# EAGLE schematic FastDataAcqSch (EAGLE 6.5.0)

## Sheet 1 of 3: ADC to FPGA
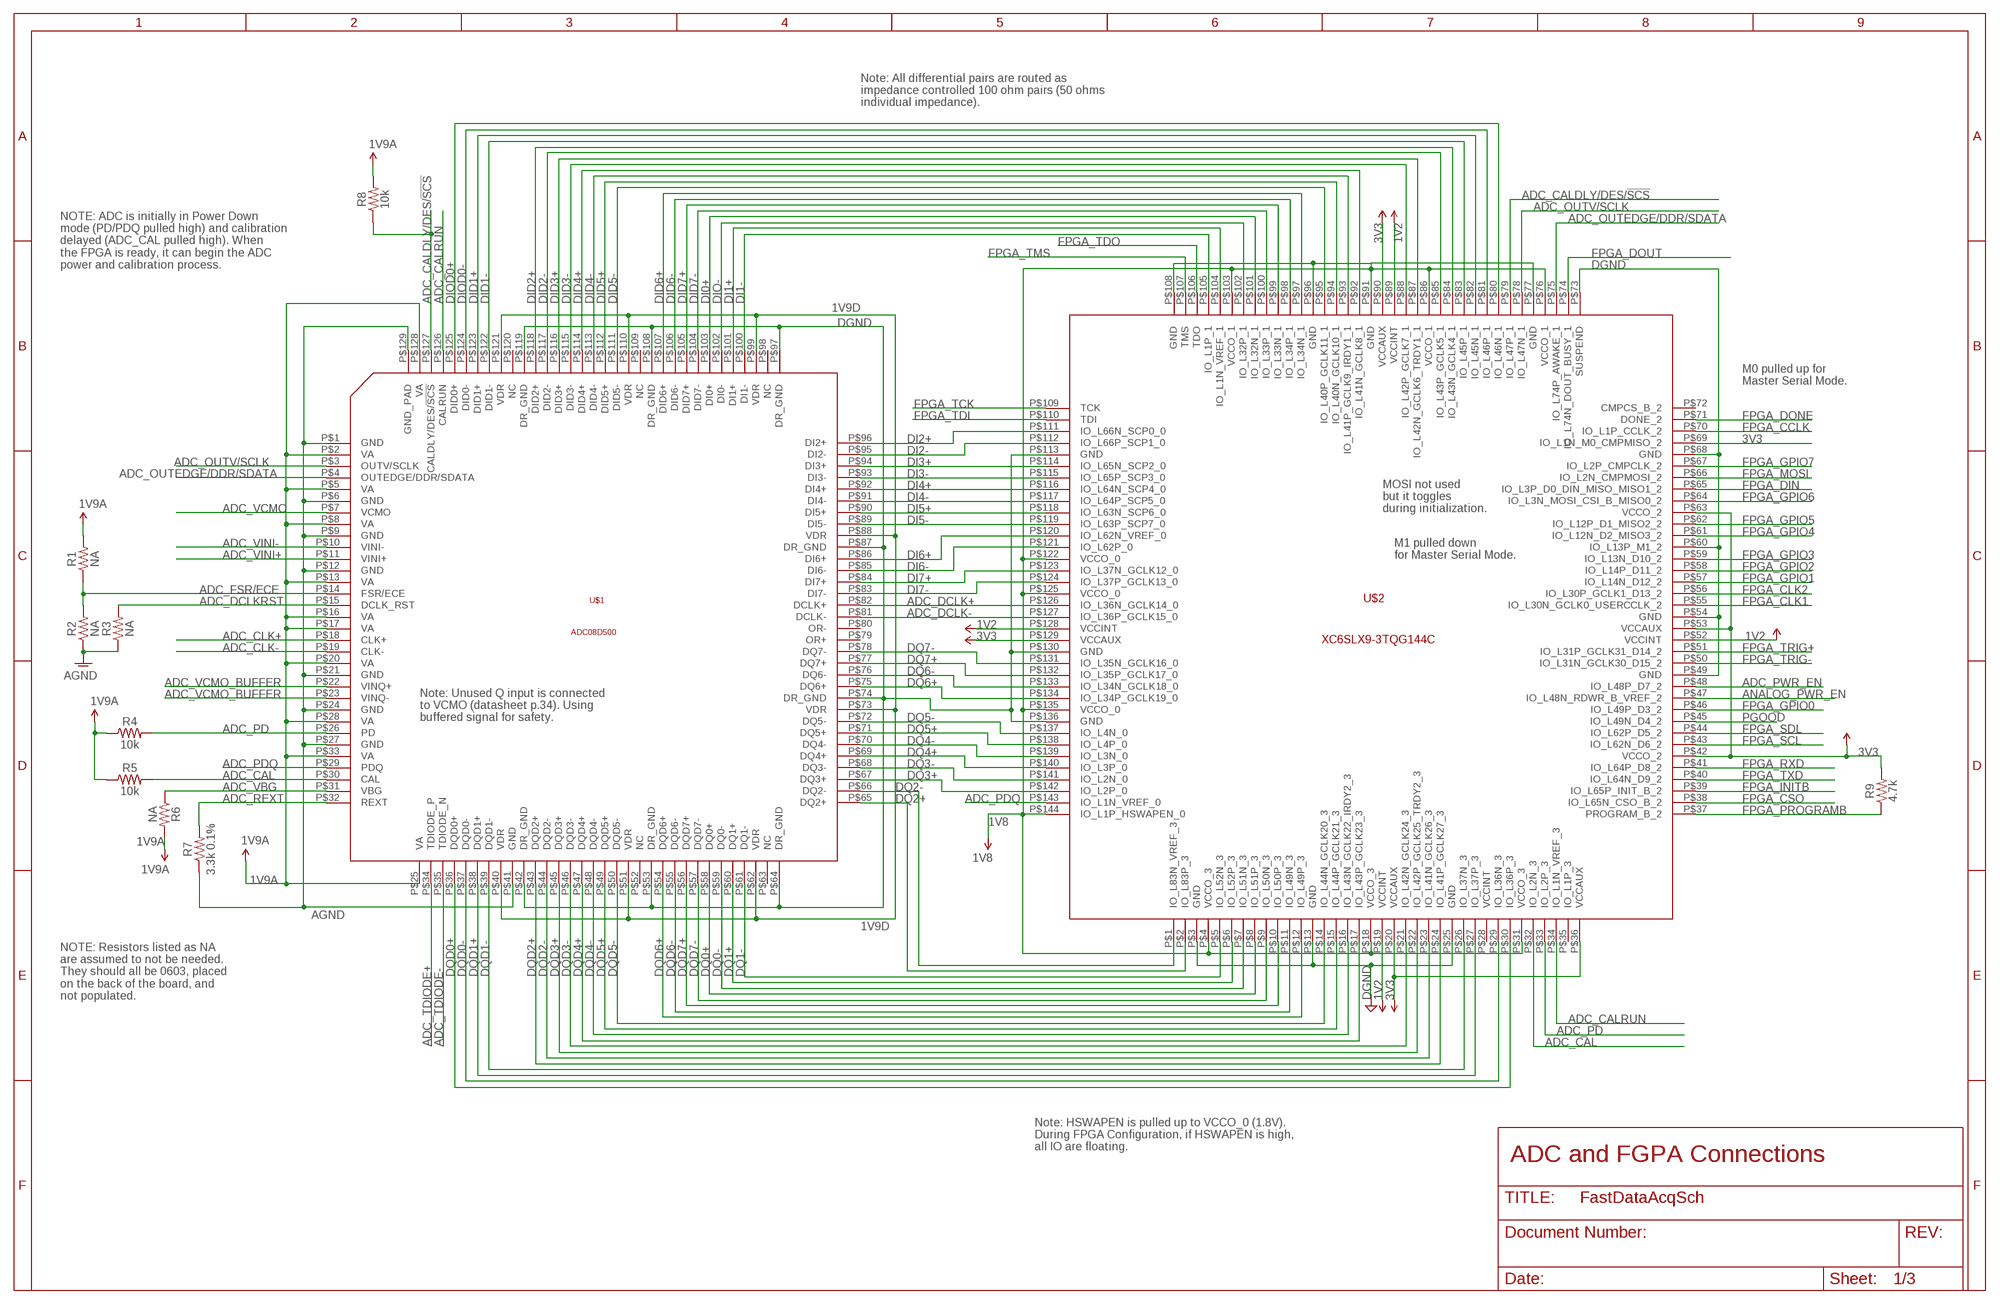
[diagram p0: schematic, sheet 1]

### Parts
R1  NA  R-US_R0603  [R0603]
R2  NA  R-US_R0603  [R0603]
R3  NA  R-US_R0603  [R0603]
R4  10k  R-US_R0201  [R0201]
R5  10k  R-US_R0201  [R0201]
R6  NA  R-US_R0603  [R0603]
R7  3.3k 0.1%  R-US_R0603  [R0603]
R8  10k  R-US_R0201  [R0201]
R9  4.7k  R-US_R0201  [R0201]
U$1  ADC08D500  [128HLQFP]
U$2  XC6SLX9-3TQG144C  [TQG144]

### Nets
1V2: U$2.P$52(VCCINT) U$2.P$89(VCCINT) U$2.P$128(VCCINT) ; also sheet 2
1V8: U$2.P$4(VCCO_3) U$2.P$18(VCCO_3) U$2.P$31(VCCO_3) U$2.P$76(VCCO_1) U$2.P$77(GND) U$2.P$86(VCCO_1) U$2.P$103(VCCO_1) U$2.P$122(VCCO_0) U$2.P$125(VCCO_0) U$2.P$135(VCCO_0) U$2.P$144(IO_L1P_HSWAPEN_0) ; also sheet 2
1V9A: R1.2 R4.1 R5.1 R6.2 R8.2 U$1.P$2(VA) U$1.P$5(VA) U$1.P$8(VA) U$1.P$13(VA) U$1.P$16(VA) U$1.P$17(VA) U$1.P$20(VA) U$1.P$25(VA) U$1.P$28(VA) U$1.P$33(VA) U$1.P$128(VA) ; also sheet 2
1V9D: U$1.P$40(VDR) U$1.P$51(VDR) U$1.P$62(VDR) U$1.P$73(VDR) U$1.P$88(VDR) U$1.P$99(VDR) U$1.P$110(VDR) U$1.P$121(VDR) ; also sheet 2
3V3: R9.2 U$2.P$36(VCCAUX) U$2.P$42(VCCO_2) U$2.P$53(VCCAUX) U$2.P$63(VCCO_2) U$2.P$69(IO_L1N_M0_CMPMISO_2) U$2.P$90(VCCAUX) U$2.P$129(VCCAUX) ; also sheet 2,3
ADC_CAL: R5.2 U$1.P$30(CAL) U$2.P$32(IO_L2N_3)
ADC_CALDLY/DES/!SCS: R8.1 U$1.P$127(CALDLY/DES/!SCS) U$2.P$79(IO_L47P_1)
ADC_CALRUN: U$1.P$126(CALRUN) U$2.P$34(IO_L1N_VREF_3)
ADC_CLK+: U$1.P$18(CLK+) ; also sheet 3
ADC_CLK-: U$1.P$19(CLK-) ; also sheet 3
ADC_DCLK+: U$1.P$82(DCLK+) U$2.P$126(IO_L36N_GCLK14_0)
ADC_DCLK-: U$1.P$81(DCLK-) U$2.P$127(IO_L36P_GCLK15_0)
ADC_DCLKRST: R3.2 U$1.P$15(DCLK_RST)
ADC_FSR/ECE: R1.1 R2.2 U$1.P$14(FSR/ECE)
ADC_OUTEDGE/DDR/SDATA: U$1.P$4(OUTEDGE/DDR/SDATA) U$2.P$75(IO_L74P_AWAKE_1)
ADC_OUTV/SCLK: U$1.P$3(OUTV/SCLK) U$2.P$78(IO_L47N_1)
ADC_PD: R4.2 U$1.P$26(PD) U$2.P$33(IO_L2P_3)
ADC_PDQ: U$1.P$29(PDQ) U$2.P$143(IO_L1N_VREF_0)
ADC_PWR_EN: U$2.P$48(IO_L48P_D7_2) ; also sheet 2
ADC_REXT: R7.2 U$1.P$32(REXT)
ADC_TDIODE+: U$1.P$34(TDIODE_P) ; also sheet 3
ADC_TDIODE-: U$1.P$35(TDIODE_N) ; also sheet 3
ADC_VBG: R6.1 U$1.P$31(VBG)
ADC_VCMO: U$1.P$7(VCMO) ; also sheet 3
ADC_VCMO_BUFFER: U$1.P$22(VINQ+) U$1.P$23(VINQ-) ; also sheet 3
ADC_VINI+: U$1.P$11(VINI+) ; also sheet 3
ADC_VINI-: U$1.P$10(VINI-) ; also sheet 3
AGND: R2.1 R3.1 R7.1 U$1.P$1(GND) U$1.P$6(GND) U$1.P$9(GND) U$1.P$12(GND) U$1.P$21(GND) U$1.P$24(GND) U$1.P$27(GND) U$1.P$41(GND) U$1.P$129(GND_PAD) ; also sheet 2,3
ANALOG_PWR_EN: U$2.P$47(IO_L48N_RDWR_B_VREF_2) ; also sheet 2
DGND: U$1.P$42(DR_GND) U$1.P$53(DR_GND) U$1.P$64(DR_GND) U$1.P$74(DR_GND) U$1.P$87(DR_GND) U$1.P$97(DR_GND) U$1.P$108(DR_GND) U$1.P$119(DR_GND) U$2.P$3(GND) U$2.P$13(GND) U$2.P$25(GND) U$2.P$49(GND) U$2.P$54(GND) U$2.P$60(IO_L13P_M1_2) U$2.P$68(GND) U$2.P$73(SUSPEND) U$2.P$113(GND) U$2.P$130(GND) U$2.P$136(GND) ; also sheet 2,3
DI0+: U$1.P$103(DI0+) U$2.P$101(IO_L32N_1)
DI1+: U$1.P$101(DI1+) U$2.P$104(IO_L1N_VREF_1)
DI1-: U$1.P$100(DI1-) U$2.P$105(IO_L1P_1)
DI2+: U$1.P$96(DI2+) U$2.P$111(IO_L66N_SCP0_0)
DI2-: U$1.P$95(DI2-) U$2.P$112(IO_L66P_SCP1_0)
DI3+: U$1.P$94(DI3+) U$2.P$114(IO_L65N_SCP2_0)
DI3-: U$1.P$93(DI3-) U$2.P$115(IO_L65P_SCP3_0)
DI4+: U$1.P$92(DI4+) U$2.P$116(IO_L64N_SCP4_0)
DI4-: U$1.P$91(DI4-) U$2.P$117(IO_L64P_SCP5_0)
DI5+: U$1.P$90(DI5+) U$2.P$118(IO_L63N_SCP6_0)
DI5-: U$1.P$89(DI5-) U$2.P$119(IO_L63P_SCP7_0)
DI6+: U$1.P$86(DI6+) U$2.P$120(IO_L62N_VREF_0)
DI6-: U$1.P$85(DI6-) U$2.P$121(IO_L62P_0)
DI7+: U$1.P$84(DI7+) U$2.P$123(IO_L37N_GCLK12_0)
DI7-: U$1.P$83(DI7-) U$2.P$124(IO_L37P_GCLK13_0)
DID1+: U$1.P$123(DID1+) U$2.P$82(IO_L45N_1)
DID1-: U$1.P$122(DID1-) U$2.P$83(IO_L45P_1)
DID2+: U$1.P$118(DID2+) U$2.P$84(IO_L43N_GCLK4_1)
DID2-: U$1.P$117(DID2-) U$2.P$85(IO_L43P_GCLK5_1)
DID3+: U$1.P$116(DID3+) U$2.P$87(IO_L42N_GCLK6_TRDY1_1)
DID3-: U$1.P$115(DID3-) U$2.P$88(IO_L42P_GCLK7_1)
DID4+: U$1.P$114(DID4+) U$2.P$92(IO_L41N_GCLK8_1)
DID4-: U$1.P$113(DID4-) U$2.P$93(IO_L41P_GCLK9_IRDY1_1)
DID5+: U$1.P$112(DID5+) U$2.P$94(IO_L40N_GCLK10_1)
DID5-: U$1.P$111(DID5-) U$2.P$95(IO_L40P_GCLK11_1)
DID6+: U$1.P$107(DID6+) U$2.P$97(IO_L34N_1)
DID6-: U$1.P$106(DID6-) U$2.P$98(IO_L34P_1)
DID7+: U$1.P$105(DID7+) U$2.P$99(IO_L33N_1)
DID7-: U$1.P$104(DID7-) U$2.P$100(IO_L33P_1)
DIO-: U$1.P$102(DI0-) U$2.P$102(IO_L32P_1)
DIOD0+: U$1.P$125(DID0+) U$2.P$80(IO_L46N_1)
DIOD0-: U$1.P$124(DID0-) U$2.P$81(IO_L46P_1)
DQ0+: U$1.P$58(DQ0+) U$2.P$8(IO_L51P_3)
DQ0-: U$1.P$59(DQ0-) U$2.P$7(IO_L51N_3)
DQ1+: U$1.P$60(DQ1+) U$2.P$6(IO_L52P_3)
DQ1-: U$1.P$61(DQ1-) U$2.P$5(IO_L52N_3)
DQ2+: U$1.P$65(DQ2+) U$2.P$2(IO_L83P_3)
DQ2-: U$1.P$66(DQ2-) U$2.P$1(IO_L83N_VREF_3)
DQ3+: U$1.P$67(DQ3+) U$2.P$142(IO_L2P_0)
DQ3-: U$1.P$68(DQ3-) U$2.P$141(IO_L2N_0)
DQ4+: U$1.P$69(DQ4+) U$2.P$140(IO_L3P_0)
DQ4-: U$1.P$70(DQ4-) U$2.P$139(IO_L3N_0)
DQ5+: U$1.P$71(DQ5+) U$2.P$138(IO_L4P_0)
DQ5-: U$1.P$72(DQ5-) U$2.P$137(IO_L4N_0)
DQ6+: U$1.P$75(DQ6+) U$2.P$134(IO_L34P_GCLK19_0)
DQ6-: U$1.P$76(DQ6-) U$2.P$133(IO_L34N_GCLK18_0)
DQ7+: U$1.P$77(DQ7+) U$2.P$132(IO_L35P_GCLK17_0)
DQ7-: U$1.P$78(DQ7-) U$2.P$131(IO_L35N_GCLK16_0)
DQD0+: U$1.P$36(DQD0+) U$2.P$30(IO_L36P_3)
DQD0-: U$1.P$37(DQD0-) U$2.P$29(IO_L36N_3)
DQD1+: U$1.P$38(DQD1+) U$2.P$27(IO_L37P_3)
DQD1-: U$1.P$39(DQD1-) U$2.P$26(IO_L37N_3)
DQD2+: U$1.P$43(DQD2+) U$2.P$24(IO_L41P_GCLK27_3)
DQD2-: U$1.P$44(DQD2-) U$2.P$23(IO_L41N_GCLK26_3)
DQD3+: U$1.P$45(DQD3+) U$2.P$22(IO_L42P_GCLK25_TRDY2_3)
DQD3-: U$1.P$46(DQD3-) U$2.P$21(IO_L42N_GCLK24_3)
DQD4+: U$1.P$47(DQD4+) U$2.P$17(IO_L43P_GCLK23_3)
DQD4-: U$1.P$48(DQD4-) U$2.P$16(IO_L43N_GCLK22_IRDY2_3)
DQD5+: U$1.P$49(DQD5+) U$2.P$15(IO_L44P_GCLK21_3)
DQD5-: U$1.P$50(DQD5-) U$2.P$14(IO_L44N_GCLK20_3)
DQD6+: U$1.P$54(DQD6+) U$2.P$12(IO_L49P_3)
DQD6-: U$1.P$55(DQD6-) U$2.P$11(IO_L49N_3)
DQD7+: U$1.P$56(DQD7+) U$2.P$10(IO_L50P_3)
DQD7-: U$1.P$57(DQD7-) U$2.P$9(IO_L50N_3)
FPGA_CCLK: U$2.P$70(IO_L1P_CCLK_2) ; also sheet 3
FPGA_CLK1: U$2.P$55(IO_L30N_GCLK0_USERCCLK_2) ; also sheet 3
FPGA_CLK2: U$2.P$56(IO_L30P_GCLK1_D13_2) ; also sheet 3
FPGA_CSO: U$2.P$38(IO_L65N_CSO_B_2)
FPGA_DIN: U$2.P$65(IO_L3P_D0_DIN_MISO_MISO1_2) ; also sheet 3
FPGA_DONE: U$2.P$71(DONE_2) ; also sheet 3
FPGA_DOUT: U$2.P$74(IO_L74N_DOUT_BUSY_1)
FPGA_GPIO0: U$2.P$46(IO_L49P_D3_2) ; also sheet 3
FPGA_GPIO1: U$2.P$57(IO_L14N_D12_2) ; also sheet 3
FPGA_GPIO2: U$2.P$58(IO_L14P_D11_2) ; also sheet 3
FPGA_GPIO3: U$2.P$59(IO_L13N_D10_2) ; also sheet 3
FPGA_GPIO4: U$2.P$61(IO_L12N_D2_MISO3_2) ; also sheet 3
FPGA_GPIO5: U$2.P$62(IO_L12P_D1_MISO2_2) ; also sheet 3
FPGA_GPIO6: U$2.P$64(IO_L3N_MOSI_CSI_B_MISO0_2) ; also sheet 3
FPGA_GPIO7: U$2.P$67(IO_L2P_CMPCLK_2) ; also sheet 3
FPGA_INITB: U$2.P$39(IO_L65P_INIT_B_2) ; also sheet 3
FPGA_MOSI: U$2.P$66(IO_L2N_CMPMOSI_2)
FPGA_PROGRAMB: R9.1 U$2.P$37(PROGRAM_B_2) ; also sheet 3
FPGA_RXD: U$2.P$41(IO_L64P_D8_2) ; also sheet 3
FPGA_SCL: U$2.P$43(IO_L62N_D6_2) ; also sheet 3
FPGA_SDL: U$2.P$44(IO_L62P_D5_2)
FPGA_TCK: U$2.P$109(TCK) ; also sheet 3
FPGA_TDI: U$2.P$110(TDI) ; also sheet 3
FPGA_TDO: U$2.P$106(TDO) ; also sheet 3
FPGA_TMS: U$2.P$107(TMS) ; also sheet 3
FPGA_TRIG+: U$2.P$51(IO_L31P_GCLK31_D14_2) ; also sheet 3
FPGA_TRIG-: U$2.P$50(IO_L31N_GCLK30_D15_2) ; also sheet 3
FPGA_TXD: U$2.P$40(IO_L64N_D9_2) ; also sheet 3
N$26: U$2.P$91(GND) U$2.P$96(GND) U$2.P$108(GND)
PGOOD: U$2.P$45(IO_L49N_D4_2) ; also sheet 2
Unconnected: U$1.P$52(NC) U$1.P$63(NC) U$1.P$79(OR+) U$1.P$80(OR-) U$1.P$98(NC) U$1.P$109(NC) U$1.P$120(NC) U$2.P$35(IO_L1P_3) U$2.P$72(CMPCS_B_2)

### Notes on the sheet
- Note: All differential pairs are routed as 
  impedance controlled 100 ohm pairs (50 ohms
  individual impedance).
- NOTE: ADC is initially in Power Down
  mode (PD/PDQ pulled high) and calibration
  delayed (ADC_CAL pulled high). When
  the FPGA is ready, it can begin the ADC
  power and calibration process.
- M0 pulled up for 
  Master Serial Mode.
- MOSI not used 
  but it toggles 
  during initialization.
- M1 pulled down 
  for Master Serial Mode.
- Note: Unused Q input is connected
  to VCMO (datasheet p.34). Using
  buffered signal for safety.
- NOTE: Resistors listed as NA 
  are assumed to not be needed. 
  They should all be 0603, placed 
  on the back of the board, and 
  not populated.
- Note: HSWAPEN is pulled up to VCCO_0 (1.8V).
  During FPGA Configuration, if HSWAPEN is high,
  all IO are floating.
- ADC and FGPA Connections

## Sheet 2 of 3: Power and Bypassing
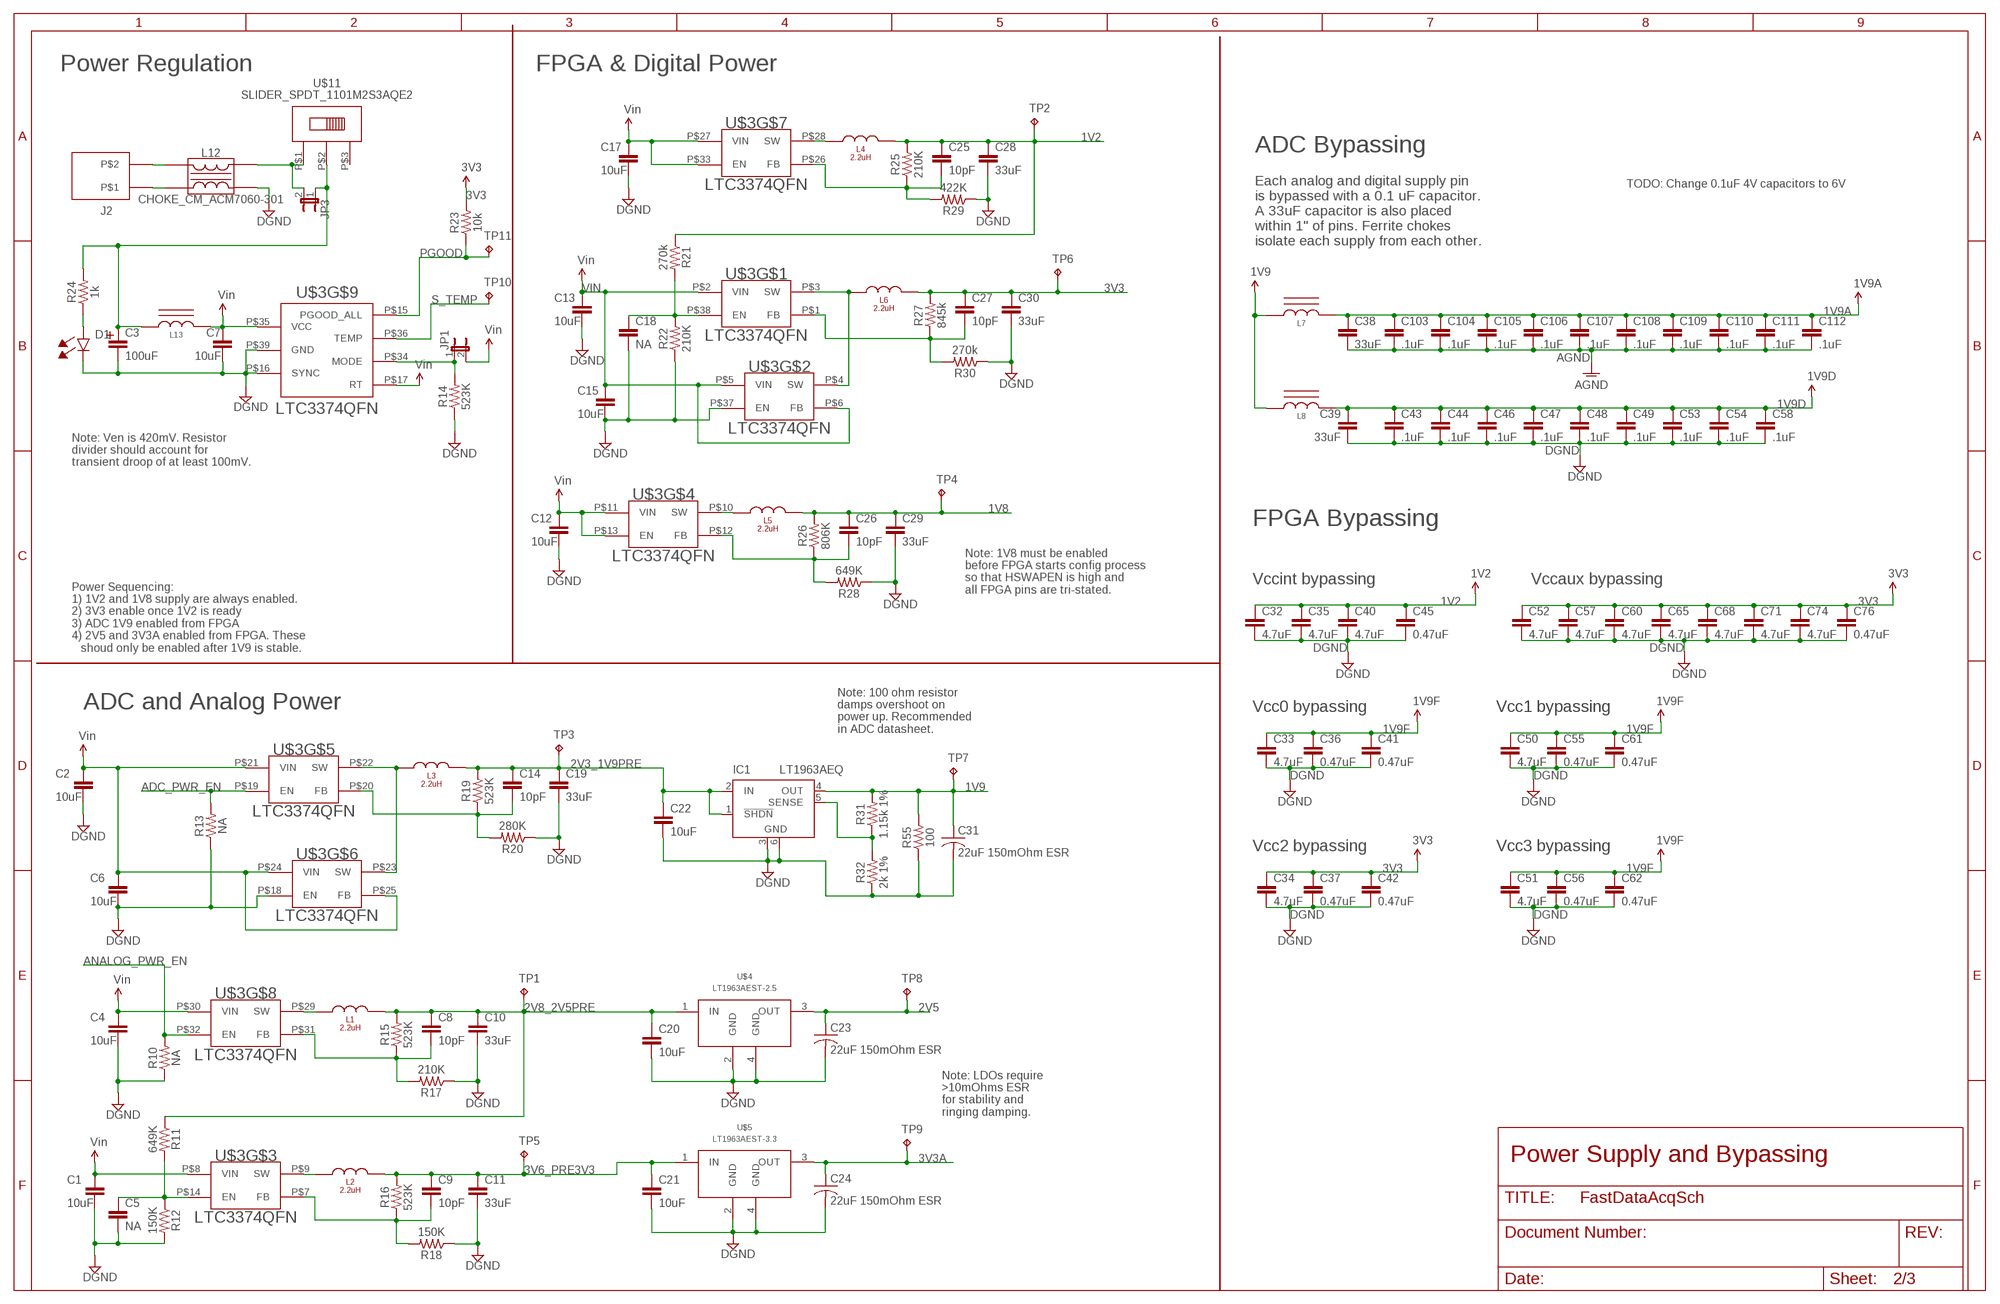
[diagram p1: schematic, sheet 2]

### Parts
C1  10uF  C-EUC0603  [C0603]
C2  10uF  C-EUC0603  [C0603]
C3  100uF  CAP_POL_D9_SERIES  [2917_MURATA_CAP]
C4  10uF  C-EUC0603  [C0603]
C5  NA  C-EUC0603  [C0603]
C6  10uF  C-EUC0603  [C0603]
C7  10uF  C-EUC0603  [C0603]
C8  10pF  C-EUC0201  [C0201]
C9  10pF  C-EUC0201  [C0201]
C10  33uF  CAP0805  [0805]
C11  33uF  CAP0805  [0805]
C12  10uF  C-EUC0603  [C0603]
C13  10uF  C-EUC0603  [C0603]
C14  10pF  C-EUC0201  [C0201]
C15  10uF  C-EUC0603  [C0603]
C17  10uF  C-EUC0603  [C0603]
C18  NA  C-EUC0603  [C0603]
C19  33uF  CAP0805  [0805]
C20  10uF  C-EUC0603  [C0603]
C21  10uF  C-EUC0603  [C0603]
C22  10uF  C-EUC0603  [C0603]
C23  22uF 150mOhm ESR  C-USC0805  [C0805]
C24  22uF 150mOhm ESR  C-USC0805  [C0805]
C25  10pF  C-EUC0201  [C0201]
C26  10pF  C-EUC0201  [C0201]
C27  10pF  C-EUC0201  [C0201]
C28  33uF  CAP0805  [0805]
C29  33uF  CAP0805  [0805]
C30  33uF  CAP0805  [0805]
C31  22uF 150mOhm ESR  C-USC0805  [C0805]
C32  4.7uF  CAPACITOR0304_REVERSE  [0306REVERSE]
C33  4.7uF  CAPACITOR0304_REVERSE  [0306REVERSE]
C34  4.7uF  CAPACITOR0304_REVERSE  [0306REVERSE]
C35  4.7uF  CAPACITOR0304_REVERSE  [0306REVERSE]
C36  0.47uF  CAPACITOR0304_REVERSE  [0306REVERSE]
C37  0.47uF  CAPACITOR0304_REVERSE  [0306REVERSE]
C38  33uF  CAP0805  [0805]
C39  33uF  CAP0805  [0805]
C40  4.7uF  CAPACITOR0304_REVERSE  [0306REVERSE]
C41  0.47uF  CAPACITOR0304_REVERSE  [0306REVERSE]
C42  0.47uF  CAPACITOR0304_REVERSE  [0306REVERSE]
C43  .1uF  CAPACITOR0204_REVERSE  [0204REVERSE]
C44  .1uF  CAPACITOR0204_REVERSE  [0204REVERSE]
C45  0.47uF  CAPACITOR0304_REVERSE  [0306REVERSE]
C46  .1uF  CAPACITOR0204_REVERSE  [0204REVERSE]
C47  .1uF  CAPACITOR0204_REVERSE  [0204REVERSE]
C48  .1uF  CAPACITOR0204_REVERSE  [0204REVERSE]
C49  .1uF  CAPACITOR0204_REVERSE  [0204REVERSE]
C50  4.7uF  CAPACITOR0304_REVERSE  [0306REVERSE]
C51  4.7uF  CAPACITOR0304_REVERSE  [0306REVERSE]
C52  4.7uF  CAPACITOR0304_REVERSE  [0306REVERSE]
C53  .1uF  CAPACITOR0204_REVERSE  [0204REVERSE]
C54  .1uF  CAPACITOR0204_REVERSE  [0204REVERSE]
C55  0.47uF  CAPACITOR0304_REVERSE  [0306REVERSE]
C56  0.47uF  CAPACITOR0304_REVERSE  [0306REVERSE]
C57  4.7uF  CAPACITOR0304_REVERSE  [0306REVERSE]
C58  .1uF  CAPACITOR0204_REVERSE  [0204REVERSE]
C60  4.7uF  CAPACITOR0304_REVERSE  [0306REVERSE]
C61  0.47uF  CAPACITOR0304_REVERSE  [0306REVERSE]
C62  0.47uF  CAPACITOR0304_REVERSE  [0306REVERSE]
C65  4.7uF  CAPACITOR0304_REVERSE  [0306REVERSE]
C68  4.7uF  CAPACITOR0304_REVERSE  [0306REVERSE]
C71  4.7uF  CAPACITOR0304_REVERSE  [0306REVERSE]
C74  4.7uF  CAPACITOR0304_REVERSE  [0306REVERSE]
C76  0.47uF  CAPACITOR0304_REVERSE  [0306REVERSE]
C103  .1uF  CAPACITOR0204_REVERSE  [0204REVERSE]
C104  .1uF  CAPACITOR0204_REVERSE  [0204REVERSE]
C105  .1uF  CAPACITOR0204_REVERSE  [0204REVERSE]
C106  .1uF  CAPACITOR0204_REVERSE  [0204REVERSE]
C107  .1uF  CAPACITOR0204_REVERSE  [0204REVERSE]
C108  .1uF  CAPACITOR0204_REVERSE  [0204REVERSE]
C109  .1uF  CAPACITOR0204_REVERSE  [0204REVERSE]
C110  .1uF  CAPACITOR0204_REVERSE  [0204REVERSE]
C111  .1uF  CAPACITOR0204_REVERSE  [0204REVERSE]
C112  .1uF  CAPACITOR0204_REVERSE  [0204REVERSE]
D1  LED_0603_RED  [0603_LED]
IC1  LT1963AEQ  [Q5-DD]
J2  MICRO-FIT_3.0_2POS_RA_SMD  [MICRO-FIT_3.02POS_RA_SMD]
JP1  JUMPER-2PTH  [1X02]
JP3  JUMPER-2PTH  [1X02]
L1  2.2uH  INDUCTOR_3X3.6  [3.0X3.6_VISHAY]
L2  2.2uH  INDUCTOR_3X3.6  [3.0X3.6_VISHAY]
L3  2.2uH  INDUCTOR_5.18X5.49  [5.18X5.49_VISHAY]
L4  2.2uH  INDUCTOR_3X3.6  [3.0X3.6_VISHAY]
L5  2.2uH  INDUCTOR_3X3.6  [3.0X3.6_VISHAY]
L6  2.2uH  INDUCTOR_5.18X5.49  [5.18X5.49_VISHAY]
L7  FERRITE_BEADS_BLM18SG260  [MURATA_BLM18]
L8  FERRITE_BEADS_BLM18SG260  [MURATA_BLM18]
L12  CHOKE_CM_ACM7060-301  [ACM7060_CHOKE]
L13  FERRITE_BEADS_BLM18SG260  [MURATA_BLM18]
R10  NA  R-US_R0603  [R0603]
R11  649K  R-US_R0201  [R0201]
R12  150K  R-US_R0201  [R0201]
R13  NA  R-US_R0603  [R0603]
R14  523K  R-US_R0201  [R0201]
R15  523K  R-US_R0201  [R0201]
R16  523K  R-US_R0201  [R0201]
R17  210K  R-US_R0201  [R0201]
R18  150K  R-US_R0201  [R0201]
R19  523K  R-US_R0201  [R0201]
R20  280K  R-US_R0201  [R0201]
R21  270k  R-US_R0201  [R0201]
R22  210K  R-US_R0201  [R0201]
R23  10k  R-US_R0201  [R0201]
R24  1k  R-US_R0201  [R0201]
R25  210K  R-US_R0201  [R0201]
R26  806K  R-US_R0201  [R0201]
R27  845k  R-US_R0201  [R0201]
R28  649K  R-US_R0201  [R0201]
R29  422K  R-US_R0201  [R0201]
R30  270k  R-US_R0201  [R0201]
R31  1.15k 1%  R-US_R0603  [R0603]
R32  2k 1%  R-US_R0603  [R0603]
R55  100  R-US_R0603  [R0603]
TP1  TPPAD1-13  [P1-13]
TP2  TPPAD1-13  [P1-13]
TP3  TPPAD1-13  [P1-13]
TP4  TPPAD1-13  [P1-13]
TP5  TPPAD1-13  [P1-13]
TP6  TPPAD1-13  [P1-13]
TP7  TPPAD1-13  [P1-13]
TP8  TPPAD1-13  [P1-13]
TP9  TPPAD1-13  [P1-13]
TP10  TPPAD1-13  [P1-13]
TP11  TPPAD1-13  [P1-13]
U$3  LTC3374QFN  [38-QFN_(5X7)]
U$4  LT1963AEST-2.5  [SOT223]
U$5  LT1963AEST-3.3  [SOT223]
U$11  SLIDER_SPDT_1101M2S3AQE2  [C_AND_K_1101M2S3AQE2]

### Nets
1V2: C25.1 C28.1 C32.P$1 C35.P$1 C40.P$1 C45.P$1 L4.P$2 R21.1 R25.2 TP2.TP ; also sheet 1
1V8: C26.1 C29.1 L5.P$2 R26.2 TP4.TP ; also sheet 1
1V9: C31.1 IC1.4(OUT) L7.P$1 L8.P$1 R31.2 R55.2 TP7.TP
1V9A: C38.1 C103.P$1 C104.P$1 C105.P$1 C106.P$1 C107.P$1 C108.P$1 C109.P$1 C110.P$1 C111.P$1 C112.P$1 L7.P$2 ; also sheet 1
1V9D: C39.1 C43.P$1 C44.P$1 C46.P$1 C47.P$1 C48.P$1 C49.P$1 C53.P$1 C54.P$1 C58.P$1 L8.P$2 ; also sheet 1
1V9F: C33.P$1 C36.P$1 C41.P$1 C50.P$1 C51.P$1 C55.P$1 C56.P$1 C61.P$1 C62.P$1
2V3_1V9PRE: C14.1 C19.1 C22.1 IC1.1(!SHDN) IC1.2(IN) L3.P$2 R19.2 TP3.TP
2V5: C23.1 TP8.TP U$4.3(OUT) ; also sheet 3
2V8_2V5PRE: C8.1 C10.1 C20.1 L1.P$2 R11.1 R15.2 TP1.TP U$4.1(IN)
3V3: C27.1 C30.1 C34.P$1 C37.P$1 C42.P$1 C52.P$1 C57.P$1 C60.P$1 C65.P$1 C68.P$1 C71.P$1 C74.P$1 C76.P$1 L6.P$2 R27.2 TP6.TP ; also sheet 1,3
3V3A: C24.1 TP9.TP U$5.3(OUT) ; also sheet 3
3V6_PRE3V3: C9.1 C11.1 C21.1 L2.P$2 R16.2 TP5.TP U$5.1(IN)
ADC_PWR_EN: R13.2 U$3.P$19(EN) ; also sheet 1
AGND: C38.2 C103.P$2 C104.P$2 C105.P$2 C106.P$2 C107.P$2 C108.P$2 C109.P$2 C110.P$2 C111.P$2 C112.P$2 ; also sheet 1,3
ANALOG_PWR_EN: R10.2 U$3.P$32(EN) ; also sheet 1
DGND: C1.2 C2.2 C3.P$1(NEG) C4.2 C5.2 C6.2 C7.2 C10.2 C11.2 C12.2 C13.2 C15.2 C17.2 C18.2 C19.2 C20.2 C21.2 C22.2 C23.2 C24.2 C28.2 C29.2 C30.2 C31.2 C32.P$2 C33.P$2 C34.P$2 C35.P$2 C36.P$2 C37.P$2 C39.2 C40.P$2 C41.P$2 C42.P$2 C43.P$2 C44.P$2 C45.P$2 C46.P$2 C47.P$2 C48.P$2 C49.P$2 C50.P$2 C51.P$2 C52.P$2 C53.P$2 C54.P$2 C55.P$2 C56.P$2 C57.P$2 C58.P$2 C60.P$2 C61.P$2 C62.P$2 C65.P$2 C68.P$2 C71.P$2 C74.P$2 C76.P$2 D1.CATHODE IC1.3(GND) IC1.6(GND) L12.P$3 R10.1 R12.2 R13.1 R14.1 R17.1 R18.1 R20.1 R22.1 R28.1 R29.1 R30.1 R32.1 R55.1 U$3.P$16(SYNC) U$3.P$18(EN) U$3.P$37(EN) U$3.P$39(GND) U$4.2(GND) U$4.4(GND) U$5.2(GND) U$5.4(GND) ; also sheet 1,3
N$1: JP3.2 L12.P$4 U$11.P$1
N$6: JP1.1 R14.2 U$3.P$34(MODE)
N$9: D1.ANODE R24.1
N$12: C18.1 R21.2 R22.2 U$3.P$38(EN)
N$14: IC1.5(SENSE) R31.1 R32.2
N$16: C5.1 R11.2 R12.1 U$3.P$14(EN)
N$17: C3.P$2(POS) JP3.1 L13.P$1 R24.2 U$11.P$2
PGOOD: R23.1 TP11.TP U$3.P$15(PGOOD_ALL) ; also sheet 1
POWER_IN+: J2.P$2 L12.P$1
POWER_IN-: J2.P$1 L12.P$2
S1FB: C27.2 R27.1 R30.2 U$3.P$1(FB)
S1SW: L6.P$1 U$3.P$3(SW) U$3.P$4(SW)
S3FB: C9.2 R16.1 R18.2 U$3.P$7(FB)
S3SW: L2.P$1 U$3.P$9(SW)
S4FB: C26.2 R26.1 R28.2 U$3.P$12(FB)
S4SW: L5.P$1 U$3.P$10(SW)
S5FB: C14.2 R19.1 R20.2 U$3.P$20(FB)
S5SW: L3.P$1 U$3.P$22(SW) U$3.P$23(SW)
S7FB: C25.2 R25.1 R29.2 U$3.P$26(FB)
S7SW: L4.P$1 U$3.P$28(SW)
S8FB: C8.2 R15.1 R17.2 U$3.P$31(FB)
S8SW: L1.P$1 U$3.P$29(SW)
S_TEMP: TP10.TP U$3.P$36(TEMP)
VCC: JP1.2 ; supply symbol labelled Vin
VIN: C1.1 C2.1 C4.1 C6.1 C7.1 C12.1 C13.1 C15.1 C17.1 L13.P$2 U$3.P$2(VIN) U$3.P$5(VIN) U$3.P$6(FB) U$3.P$8(VIN) U$3.P$11(VIN) U$3.P$13(EN) U$3.P$17(RT) U$3.P$21(VIN) U$3.P$24(VIN) U$3.P$25(FB) U$3.P$27(VIN) U$3.P$30(VIN) U$3.P$33(EN) U$3.P$35(VCC) ; supply symbol labelled Vin
Unconnected: R23.2 U$11.P$3

### Notes on the sheet
- Power Regulation | FPGA & Digital Power
- ADC Bypassing
- TODO: Change 0.1uF 4V capacitors to 6V
- Each analog and digital supply pin
  is bypassed with a 0.1 uF capacitor.
  A 33uF capacitor is also placed 
  within 1" of pins. Ferrite chokes 
  isolate each supply from each other.
- Note: Ven is 420mV. Resistor
  divider should account for 
  transient droop of at least 100mV.
- FPGA Bypassing
- Vccint bypassing | Vccaux bypassing
- Note: 1V8 must be enabled
  before FPGA starts config process
  so that HSWAPEN is high and
  all FPGA pins are tri-stated.
- Power Sequencing: 
  1) 1V2 and 1V8 supply are always enabled.
  2) 3V3 enable once 1V2 is ready
  3) ADC 1V9 enabled from FPGA
  4) 2V5 and 3V3A enabled from FPGA. These
     shoud only be enabled after 1V9 is stable.
- ADC and Analog Power | Vcc0 bypassing | Vcc1 bypassing
- Note: 100 ohm resistor
  damps overshoot on
  power up. Recommended
  in ADC datasheet.
- Vcc2 bypassing | Vcc3 bypassing
- Note: LDOs require
  >10mOhms ESR
  for stability and
  ringing damping.
- Power Supply and Bypassing

## Sheet 3 of 3: Ancillary Circuits (clocks, ADC front end, PROM, USB, etc.)
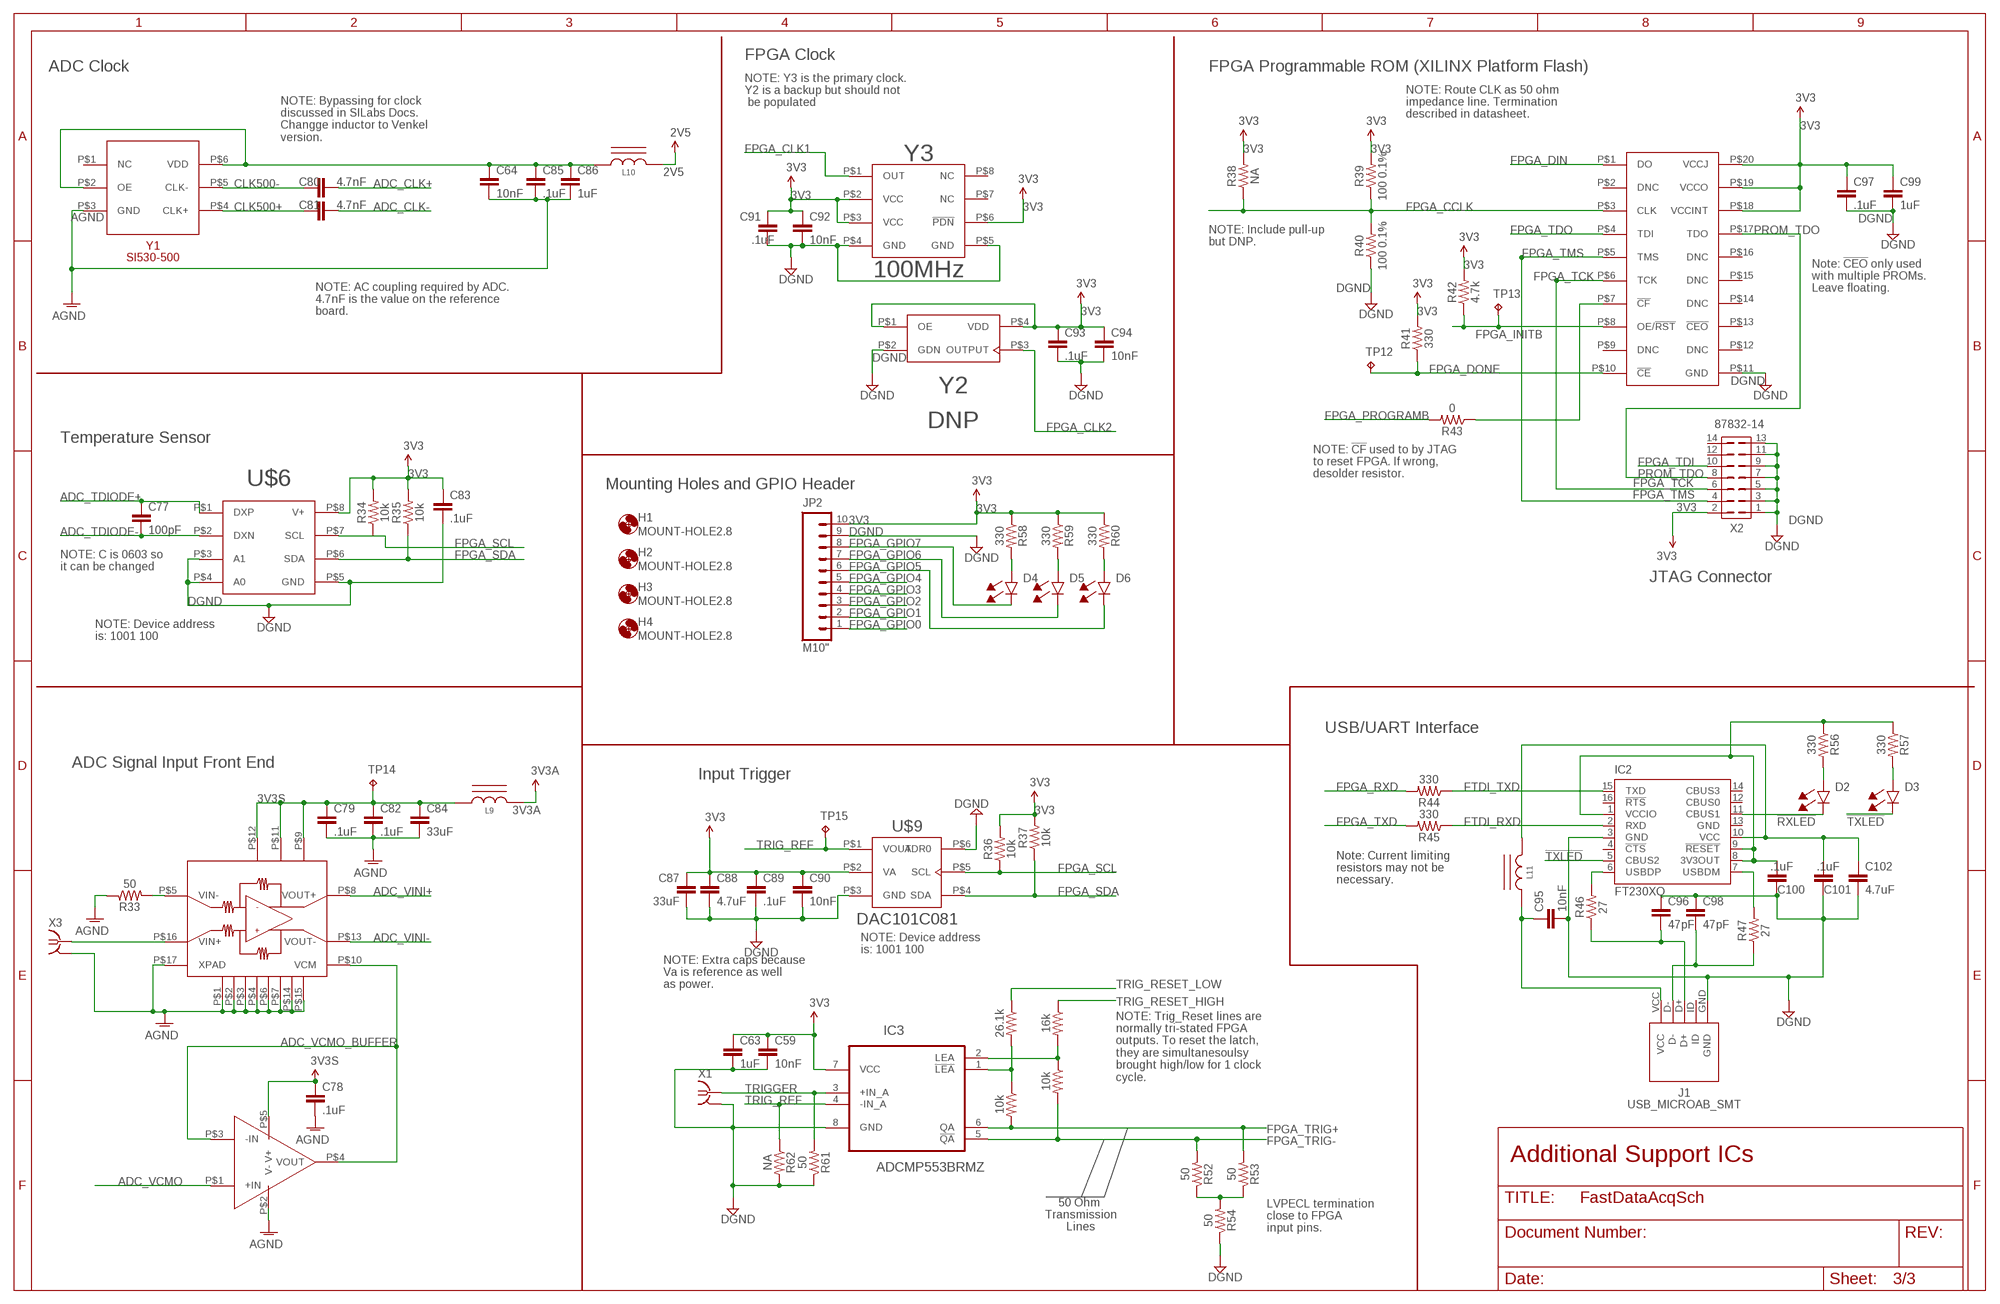
[diagram p2: schematic, sheet 3]

### Parts
C59  10nF  C-EUC0201  [C0201]
C63  1uF  CAPACITOR0204_REVERSE  [0204REVERSE]
C64  10nF  C-EUC0201  [C0201]
C77  100pF  C-EUC0603  [C0603]
C78  .1uF  CAPACITOR0204_REVERSE  [0204REVERSE]
C79  .1uF  CAPACITOR0204_REVERSE  [0204REVERSE]
C80  4.7nF  C-EUC0201  [C0201]
C81  4.7nF  C-EUC0201  [C0201]
C82  .1uF  CAPACITOR0204_REVERSE  [0204REVERSE]
C83  .1uF  CAPACITOR0204_REVERSE  [0204REVERSE]
C84  33uF  CAP0805  [0805]
C85  .1uF  CAPACITOR0204_REVERSE  [0204REVERSE]
C86  1uF  CAPACITOR0204_REVERSE  [0204REVERSE]
C87  33uF  CAP0805  [0805]
C88  4.7uF  CAPACITOR0304_REVERSE  [0306REVERSE]
C89  .1uF  CAPACITOR0204_REVERSE  [0204REVERSE]
C90  10nF  C-EUC0201  [C0201]
C91  .1uF  CAPACITOR0204_REVERSE  [0204REVERSE]
C92  10nF  C-EUC0201  [C0201]
C93  .1uF  CAPACITOR0204_REVERSE  [0204REVERSE]
C94  10nF  C-EUC0201  [C0201]
C95  10nF  C-EUC0201  [C0201]
C96  47pF  C-EUC0201  [C0201]
C97  .1uF  CAPACITOR0204_REVERSE  [0204REVERSE]
C98  47pF  C-EUC0201  [C0201]
C99  1uF  CAPACITOR0204_REVERSE  [0204REVERSE]
C100  .1uF  CAPACITOR0204_REVERSE  [0204REVERSE]
C101  .1uF  CAPACITOR0204_REVERSE  [0204REVERSE]
C102  4.7uF  CAPACITOR0304_REVERSE  [0306REVERSE]
D2  LED_0603_GREEN  [0603_LED]
D3  LED_0603_BLUE  [0603_LED]
D4  LED_0603_BLUE  [0603_LED]
D5  LED_0603_GREEN  [0603_LED]
D6  LED_0603_RED  [0603_LED]
H1  MOUNT-HOLE2.8  [2,8]
H2  MOUNT-HOLE2.8  [2,8]
H3  MOUNT-HOLE2.8  [2,8]
H4  MOUNT-HOLE2.8  [2,8]
IC2  FT230XQ  [QFN16]
IC3  ADCMP553BRMZ  [SOP65P490X110-8N]
J1  USB_MICROAB_SMT  [USB_MICROAB_SMT_1]
JP2  M10"  [1X10]
L9  FERRITE_BEADS_BLM18SG260  [MURATA_BLM18]
L10  FERRITE_BEADS_BLM18SG260  [MURATA_BLM18]
L11  FERRITE_BEADS_BLM18SG331  [MURATA_BLM18]
R33  50  R-US_R0201  [R0201]
R34  10k  R-US_R0201  [R0201]
R35  10k  R-US_R0201  [R0201]
R36  10k  R-US_R0201  [R0201]
R37  10k  R-US_R0201  [R0201]
R38  NA  R-US_R0603  [R0603]
R39  100 0.1%  R-US_R0402  [R0402]
R40  100 0.1%  R-US_R0402  [R0402]
R41  330  R-US_R0201  [R0201]
R42  4.7k  R-US_R0201  [R0201]
R43  0  R-US_R0603  [R0603]
R44  330  R-US_R0201  [R0201]
R45  330  R-US_R0201  [R0201]
R46  27  R-US_R0201  [R0201]
R47  27  R-US_R0201  [R0201]
R48  10k  R-US_R0603  [R0603]
R49  26.1k  R-US_R0603  [R0603]
R50  10k  R-US_R0603  [R0603]
R51  16k  R-US_R0603  [R0603]
R52  50  R-US_R0201  [R0201]
R53  50  R-US_R0201  [R0201]
R54  50  R-US_R0201  [R0201]
R56  330  R-US_R0201  [R0201]
R57  330  R-US_R0201  [R0201]
R58  330  R-US_R0201  [R0201]
R59  330  R-US_R0201  [R0201]
R60  330  R-US_R0201  [R0201]
R61  50  R-US_R0201  [R0201]
R62  NA  R-US_R0603  [R0603]
TP12  TPPAD1-13  [P1-13]
TP13  TPPAD1-13  [P1-13]
TP14  TPPAD1-13  [P1-13]
TP15  TPPAD1-13  [P1-13]
U$6  TMP421  [SOT23-8]
U$7  LMH6555  [16WQFN]
U$8  LMV321SC-70  [SC-70]
U$9  DAC101C081  [SOT23-6]
U$10  XCFXXS04  [TSSOP20_XILINX]
X1  SMA-142-0701-801/806  [J502-ND-142-0701-801/806]
X2  87832-14  [87832-14]
X3  SMA-142-0701-801/806  [J502-ND-142-0701-801/806]
Y1  SI530-500  [SI530]
Y2  DNP  SI500S  [SI500S]
Y3  100MHz  DS1088L_100MHZ  [UMAX8]

### Nets
2V5: L10.P$2 ; also sheet 2
2V5A: C64.1 C85.P$1 C86.P$1 L10.P$1 Y1.P$2(OE) Y1.P$6(VDD)
3V3: C59.1 C63.P$1 C83.P$1 C87.1 C88.P$1 C89.P$1 C90.1 C91.P$1 C92.1 C93.P$1 C94.1 C97.P$1 C99.P$1 IC3.7(VCC) JP2.10 R35.2 R36.2 R37.2 R38.2 R39.2 R41.2 R58.1 R59.1 R60.1 U$6.P$8(V+) U$9.P$2(VA) U$10.P$18(VCCINT) U$10.P$19(VCCO) U$10.P$20(VCCJ) X2.2 Y2.P$1(OE) Y2.P$4(VDD) Y3.P$2(VCC) Y3.P$3(VCC) Y3.P$6(!PDN) ; also sheet 1,2
3V3A: L9.P$2 ; also sheet 2
3V3S: C78.P$1 C79.P$1 C82.P$1 C84.1 L9.P$1 TP14.TP U$7.P$9(VCC) U$7.P$11(VCC) U$7.P$12(VCC) U$8.P$5(V+)
5VUSB: C101.P$2 C102.P$1 IC2.10(VCC) L11.P$2
5VUSB_CON: C95.1 J1.VCC L11.P$1
!RXLED: D2.CATHODE IC2.11(CBUS1)
!TXLED: D3.CATHODE IC2.5(CBUS2)
ADC_CLK+: C80.2 ; also sheet 1
ADC_CLK-: C81.2 ; also sheet 1
ADC_TDIODE+: C77.1 U$6.P$1(DXP) ; also sheet 1
ADC_TDIODE-: C77.2 U$6.P$2(DXN) ; also sheet 1
ADC_VCMO: U$8.P$1(+IN) ; also sheet 1
ADC_VCMO_BUFFER: U$7.P$10(VCM) U$8.P$3(-IN) U$8.P$4(VOUT) ; also sheet 1
ADC_VINI+: U$7.P$8(VOUT+) ; also sheet 1
ADC_VINI-: U$7.P$13(VOUT-) ; also sheet 1
AGND: C64.2 C78.P$2 C79.P$2 C82.P$2 C84.2 C85.P$2 C86.P$2 R33.1 U$7.P$1(GND) U$7.P$2(GND) U$7.P$3(GND) U$7.P$4(GND) U$7.P$6(GND) U$7.P$7(GND) U$7.P$14(GND) U$7.P$15(GND) U$7.P$17(XPAD) U$8.P$2(V-) X3.G@1 X3.G@2 X3.G@3 X3.G@4 Y1.P$3(GND) ; also sheet 1,2
CLK500+: C81.1 Y1.P$4(CLK+)
CLK500-: C80.1 Y1.P$5(CLK-)
DGND: C59.2 C63.P$2 C83.P$2 C87.2 C88.P$2 C89.P$2 C90.2 C91.P$2 C92.2 C93.P$2 C94.2 C95.2 C96.1 C97.P$2 C98.1 C99.P$2 C100.P$1 C101.P$1 C102.P$2 IC2.3(GND) IC3.8(GND) J1.GND JP2.9 R40.1 R54.1 R61.1 R62.2 U$6.P$3(A1) U$6.P$4(A0) U$6.P$5(GND) U$9.P$3(GND) U$9.P$6(ADR0) U$10.P$11(GND) X1.G@1 X1.G@2 X1.G@3 X1.G@4 X2.1 X2.3 X2.5 X2.7 X2.9 X2.11 X2.13 Y2.P$2(GDN) Y3.P$4(GND) Y3.P$5(GND) ; also sheet 1,2
FPGA_CCLK: R38.1 R39.1 R40.2 U$10.P$3(CLK) ; also sheet 1
FPGA_CLK1: Y3.P$1(OUT) ; also sheet 1
FPGA_CLK2: Y2.P$3(OUTPUT) ; also sheet 1
FPGA_DIN: U$10.P$1(DO) ; also sheet 1
FPGA_DONE: R41.1 TP12.TP U$10.P$10(!CE) ; also sheet 1
FPGA_GPIO0: JP2.1 ; also sheet 1
FPGA_GPIO1: JP2.2 ; also sheet 1
FPGA_GPIO2: JP2.3 ; also sheet 1
FPGA_GPIO3: JP2.4 ; also sheet 1
FPGA_GPIO4: JP2.5 ; also sheet 1
FPGA_GPIO5: D6.CATHODE JP2.6 ; also sheet 1
FPGA_GPIO6: D5.CATHODE JP2.7 ; also sheet 1
FPGA_GPIO7: D4.CATHODE JP2.8 ; also sheet 1
FPGA_INITB: TP13.TP U$10.P$8(OE/!RST) ; also sheet 1
FPGA_PROGRAMB: R43.2 ; also sheet 1
FPGA_RXD: R44.2 ; also sheet 1
FPGA_SCL: R36.1 U$6.P$7(SCL) U$9.P$5(SCL) ; also sheet 1
FPGA_SDA: R35.1 R37.1 U$6.P$6(SDA) U$9.P$4(SDA)
FPGA_TCK: U$10.P$6(TCK) X2.6 ; also sheet 1
FPGA_TDI: X2.10 ; also sheet 1
FPGA_TDO: U$10.P$4(TDI) ; also sheet 1
FPGA_TMS: U$10.P$5(TMS) X2.4 ; also sheet 1
FPGA_TRIG+: IC3.6(QA) R48.2 R53.2 ; also sheet 1
FPGA_TRIG-: IC3.5(!QA) R50.2 R52.2 ; also sheet 1
FPGA_TXD: R45.2 ; also sheet 1
FTDI_RXD: IC2.2(RXD) R45.1
FTDI_TXD: IC2.15(TXD) R44.1
N$2: R33.2 U$7.P$5(VIN-)
N$3: IC2.6(USBDP) R46.2
N$4: C96.2 J1.D+ R46.1
N$5: C98.2 J1.D- R47.1
N$7: IC2.7(USBDM) R47.2
N$8: C100.P$2 IC2.1(VCCIO) IC2.8(3V3OUT) IC2.9(!RESET) R56.1 R57.1
N$10: D2.ANODE R56.2
N$11: R43.1 U$10.P$7(!CF)
N$13: D3.ANODE R57.2
N$15: IC3.1(!LEA) R48.1 R49.2
N$18: R52.1 R53.1 R54.2
N$19: D6.ANODE R60.2
N$20: IC3.2(LEA) R50.1 R51.2
N$21: D5.ANODE R59.2
N$22: D4.ANODE R58.2
PROM_TDO: U$10.P$17(TDO) X2.8
SIGNAL_IN: U$7.P$16(VIN+) X3.1
TRIG_REF: IC3.4(-IN_A) R62.1 TP15.TP U$9.P$1(VOUT)
TRIG_RESET_HIGH: R51.1
TRIG_RESET_LOW: R49.1
TRIGGER: IC3.3(+IN_A) R61.2 X1.1
Unconnected: IC2.4(!CTS) IC2.12(CBUS0) IC2.14(CBUS3) IC2.16(!RTS) J1.ID R34.1 R34.2 R42.1 R42.2 U$10.P$2(DNC) U$10.P$9(DNC) U$10.P$12(DNC) U$10.P$13(!CEO) U$10.P$14(DNC) U$10.P$15(DNC) U$10.P$16(DNC) X2.12 X2.14 Y1.P$1(NC) Y3.P$7(NC) Y3.P$8(NC)

### Notes on the sheet
- FPGA Clock
- ADC Clock | FPGA Programmable ROM (XILINX Platform Flash)
- NOTE: Y3 is the primary clock. 
  Y2 is a backup but should not
   be populated
- NOTE: Route CLK as 50 ohm
  impedance line. Termination
  described in datasheet.
- NOTE: Bypassing for clock 
  discussed in SILabs Docs. 
  Changge inductor to Venkel 
  version.
- NOTE: Include pull-up
  but DNP.
- Note: !CEO! only used 
  with multiple PROMs. 
  Leave floating.
- NOTE: AC coupling required by ADC. 
  4.7nF is the value on the reference 
  board.
- Temperature Sensor
- NOTE: !CF! used to by JTAG 
  to reset FPGA. If wrong, 
  desolder resistor.
- Mounting Holes and GPIO Header
- NOTE: C is 0603 so
  it can be changed
- JTAG Connector
- NOTE: Device address
  is: 1001 100
- USB/UART Interface
- ADC Signal Input Front End
- Input Trigger
- Note: Current limiting
  resistors may not be 
  necessary.
- NOTE: Device address
  is: 1001 100
- NOTE: Extra caps because 
  Va is reference as well
  as power.
- NOTE: Trig_Reset lines are 
  normally tri-stated FPGA 
  outputs. To reset the latch, 
  they are simultanesoulsy
  brought high/low for 1 clock 
  cycle.
- Additional Support ICs
- 50 Ohm 
  Transmission
  Lines
- LVPECL termination
  close to FPGA
  input pins.

## Power pins joined to a net without a drawn wire
GND: IC2.13(GND)
VCCAUX: U$2.P$20(VCCAUX)
VCCINT: U$2.P$19(VCCINT) U$2.P$28(VCCINT)

## Library data of the parts
C1 C2 C4 C6 C7 C12 C13 C15 C17 C20-C22 = rcl:C-EU: CAPACITOR, European symbol; PARTNUMBER: 445-4112-1-ND; SUPPLIER: DIGIKEY
C3 = Schuyler:CAP_POL_: Polarized capacitors.; MANPARTNUMBER: ECASD91B107M012K00; MANUFACTURER: Murata Electronics North America; PARTNUMBER: 490-5480-1-ND; SUPPLIER: DIGIKEY
C5 C18 = rcl:C-EU: CAPACITOR, European symbol
C8 C9 C14 C25-C27 = rcl:C-EU: CAPACITOR, European symbol; PARTNUMBER: 445-1769-1-ND; SUPPLIER: DIGIKEY
C10 C11 C19 C28-C30 C38 C39 C84 C87 = SparkFun-Passives:CAP: Capacitor Standard 0603 ceramic capacitor, and 0.1" leaded capacitor.; PARTNUMBER: 445-8238-1-ND; SUPPLIER: DIGIKEY
C23 C24 C31 = rcl:C-US: CAPACITOR, American symbol; PARTNUMBER: P16231CT-ND; SUPPLIER: DIGIKEY
C32-C35 C40 C50-C52 C57 C60 C65 C68 C71 C74 C88 C102 = Schuyler:CAPACITOR: Capacitors.; PARTNUMBER: 445-13745-1-ND; SUPPLIER: DIGIKEY
C36 C37 C41 C42 C45 C55 C56 C61 C62 C76 = Schuyler:CAPACITOR: Capacitors.; PARTNUMBER: 445-13744-1-ND; SUPPLIER: DIGIKEY
C43 C44 C46-C49 C53 C54 C58 C78 C79 C82 C83 C85 C89 C91 C93 C97 C100 C101 C103-C112 = Schuyler:CAPACITOR: Capacitors.; PARTNUMBER: 587-2152-1-ND; SUPPLIER: DIGIKEY
C59 C64 C90 C92 C94 C95 = rcl:C-EU: CAPACITOR, European symbol; PARTNUMBER: 445-1793-1-ND; SUPPLIER: DIGIKEY
C63 C86 C99 = Schuyler:CAPACITOR: Capacitors.; PARTNUMBER: 445-9091-1-ND; SUPPLIER: DIGIKEY
C77 = rcl:C-EU: CAPACITOR, European symbol; PARTNUMBER: 1276-1295-1-ND; SUPPLIER: DIGIKEY
C80 C81 = rcl:C-EU: CAPACITOR, European symbol; PARTNUMBER: 445-1795-1-ND; SUPPLIER: DIGIKEY
C96 C98 = rcl:C-EU: CAPACITOR, European symbol; PARTNUMBER: 445-1782-1-ND; SUPPLIER: DIGIKEY
D1 D6 = Schuyler:LED_: LED.; MANPARTNUMBER: LTST-C193KRKT-5A; MANUFACTURER: Lite-On Inc; PARTNUMBER: 160-1830-1-ND; SUPPLIER: DIGIKEY
D2 D5 = Schuyler:LED_: LED.; MANPARTNUMBER: LTST-C193KGKT-5A; MANUFACTURER: Lite-On Inc; PARTNUMBER: 160-1828-1-ND; SUPPLIER: DIGIKEY
D3 D4 = Schuyler:LED_: LED.; MANPARTNUMBER: LTST-C193TBKT-5A; MANUFACTURER: Lite-On Inc; PARTNUMBER: 160-1827-1-ND; SUPPLIER: DIGIKEY
H1-H4 = holes:MOUNT-HOLE: MOUNTING HOLE with drill center marker
IC1 = linear-technology:LT1963AEQ*: LT1963 1.5A, Low Noise, Fast Transient Response LDO Regulator Source: http://www.linear.com; MANPARTNUMBER: LT1963AEQ#PBF; MANUFACTURER: Linear Technology; MPN: LT1963AEQ; OC_FARNELL: 1273625; OC_NEWARK: 57M7427; PARTNUMBER: LT1963AEQ#PBF-ND; SUPPLIER: DIGIKEY
IC2 = ftdichip:FT230X: USB to BASIC UART IC Auto generated by make-symbol-device-package-bsdl.ulp Rev. 43 Source: Data sheet <http://www.ftdichip.com/Support/Documents/DataSheets/ICs/DS_FT230X.pdf>; MANPARTNUMBER: FT230XQ-R; MANUFACTURER: FTDI; PARTNUMBER: 768-1130-1-ND; SUPPLIER: DIGIKEY
IC3 = Schuyler:ADCMP553BRMZ: PECL/LVPECL Comparators; MANPARTNUMBER: ADCMP553BRMZ; MANUFACTURER: Analog Devices; PARTNUMBER: ADCMP553BRMZ-ND; SUPPLIER: DIGIKEY
J1 = Schuyler:USB_: USB Connector; MANPARTNUMBER: 10104111-0001LF; MANUFACTURER: FCI; PARTNUMBER: 609-4053-1-ND; SUPPLIER: DIGIKEY
J2 = Schuyler:MICRO-FIT_3.0_2POS_; MANPARTNUMBER: 0436500212; MANUFACTURER: Molex Inc; PARTNUMBER: WM1890CT-ND; SUPPLIER: DIGIKEY
JP1 JP3 = SparkFun-Passives:JUMPER-2: Jumper Basic 0.1" spaced jumper. Use with breakaway headers.
JP2 = SparkFun-Connectors:M10: Header 10 Standard 10-pin 0.1" header. Use with straight break away headers (SKU : PRT-00116), right angle break away headers (PRT-00553), swiss pins (PRT-00743), machine pins (PRT-00117), and female headers (PRT-00115).
L1 L2 L4 L5 = Schuyler:INDUCTOR: Inductors.; PARTNUMBER: 541-1322-1-ND; SUPPLIER: DIGIKEY
L3 L6 = Schuyler:INDUCTOR: Inductors.; PARTNUMBER: 541-1220-1-ND; SUPPLIER: DIGIKEY
L7-L10 L13 = Schuyler:FERRITE_BEADS_: Ferrite bead.; MANPARTNUMBER: BLM18SG260TN1D; MANUFACTURER: Murata Electronics North America; PARTNUMBER: 490-3995-1-ND; SUPPLIER: DIGIKEY
L11 = Schuyler:FERRITE_BEADS_: Ferrite bead.; MANPARTNUMBER: BLM18SG331TN1D; MANUFACTURER: Murata Electronics North America; PARTNUMBER: 490-3997-1-ND; SUPPLIER: DIGIKEY
L12 = Schuyler:CHOKE_CM_: Common mode choke.; MANPARTNUMBER: ACM7060-301-2PL-TL01; MANUFACTURER: TDK Corporation; PARTNUMBER: 445-2214-1-ND; SUPPLIER: DIGIKEY
R1-R3 R6 R10 R13 R38 = rcl:R-US_: RESISTOR, American symbol
R4 R5 R8 R23 R34-R37 = rcl:R-US_: RESISTOR, American symbol; MANPARTNUMBER: RC0603J103CS; MANUFACTURER: Samsung Electro-Mechanics America, Inc; PARTNUMBER: 1276-3817-1-ND; SUPPLIER: DIGIKEY
R7 = rcl:R-US_: RESISTOR, American symbol; PARTNUMBER: P3.3KDBCT-ND; SUPPLIER: DIGIKEY
R9 R42 = rcl:R-US_: RESISTOR, American symbol; MANPARTNUMBER: ERJ-1GNJ472C; MANUFACTURER: Panasonic Electronic Components; PARTNUMBER: P4.7AECT-ND; SUPPLIER: DIGIKEY
R11 R28 = rcl:R-US_: RESISTOR, American symbol; PARTNUMBER: P649KABCT-ND; SUPPLIER: DIGIKEY
R12 R18 = rcl:R-US_: RESISTOR, American symbol; PARTNUMBER: 1276-3719-1-ND; SUPPLIER: DIGIKEY
R14-R16 R19 = rcl:R-US_: RESISTOR, American symbol; PARTNUMBER: P523KABCT-ND; SUPPLIER: DIGIKEY
R17 R22 R25 = rcl:R-US_: RESISTOR, American symbol; PARTNUMBER: P210KABCT-ND; SUPPLIER: DIGIKEY
R20 = rcl:R-US_: RESISTOR, American symbol; PARTNUMBER: P280KABCT-ND; SUPPLIER: DIGIKEY
R21 R30 = rcl:R-US_: RESISTOR, American symbol; PARTNUMBER: P270KABCT-ND; SUPPLIER: DIGIKEY
R24 = rcl:R-US_: RESISTOR, American symbol; PARTNUMBER: 1276-3797-1-ND; SUPPLIER: DIGIKEY
R26 = rcl:R-US_: RESISTOR, American symbol; PARTNUMBER: P806KABCT-ND; SUPPLIER: DIGIKEY
R27 = rcl:R-US_: RESISTOR, American symbol; PARTNUMBER: P845KABCT-ND; SUPPLIER: DIGIKEY
R29 = rcl:R-US_: RESISTOR, American symbol; PARTNUMBER: P442KABCT-ND; SUPPLIER: DIGIKEY
R31 = rcl:R-US_: RESISTOR, American symbol; MANPARTNUMBER: RC1608F1151CS; MANUFACTURER: Samsung Electro-Mechanics America, Inc; PARTNUMBER: 1276-4649-1-ND; SUPPLIER: DIGIKEY
R32 = rcl:R-US_: RESISTOR, American symbol; MANPARTNUMBER: RC1608F202CS; MANUFACTURER: Samsung Electro-Mechanics America, Inc; PARTNUMBER: 1276-3495-1-ND; SUPPLIER: DIGIKEY
R33 R52-R54 R61 = rcl:R-US_: RESISTOR, American symbol; MANPARTNUMBER: RC0603F49R9C; MANUFACTURER: Samsung Electro-Mechanics America, Inc; PARTNUMBER: 1276-3590-1-ND; SUPPLIER: DIGIKEY
R39 R40 = rcl:R-US_: RESISTOR, American symbol; MANPARTNUMBER: ERA-2AEB101X; MANUFACTURER: Panasonic Electronic Components; PARTNUMBER: P100DCCT-ND; SUPPLIER: DIGIKEY
R41 R44 R45 R56-R60 = rcl:R-US_: RESISTOR, American symbol; MANPARTNUMBER: RC0603J331CS; MANUFACTURER: Samsung Electro-Mechanics America, Inc; PARTNUMBER: 1276-3787-1-ND; SUPPLIER: DIGIKEY
R43 R48-R51 R62 = rcl:R-US_: RESISTOR, American symbol; PARTNUMBER: 311-0.0GRCT-ND; SUPPLIER: DIGIKEY
R46 R47 = rcl:R-US_: RESISTOR, American symbol; PARTNUMBER: 1276-3577-1-ND; SUPPLIER: DIGIKEY
R55 = rcl:R-US_: RESISTOR, American symbol; MANPARTNUMBER: RC1608J101CS; MANUFACTURER: Samsung Electro-Mechanics America, Inc; PARTNUMBER: 1276-5038-1-ND; SUPPLIER: DIGIKEY
TP1-TP15 = testpad:TP: Test pad
U$1 = Schuyler:ADC08D500: TI ADC08D500 is a dual ADC running at 500MHz for a total of 1 GSPS. Verified=false.; PARTNUMBER: ADC08D500CIYB/NOPB-ND; SUPPLIER: DIGIKEY
U$2 = Schuyler:XC6SLX9-3TQG144C: Xilinx Spartan 6 LX9 FPGA in the TQG144 package.; MANPARTNUMBER: XC6SLX9-3TQG144C; MANUFACTURER: Xilinx Inc; PARTNUMBER: 122-1747-ND; SUPPLIER: DIGIKEY
U$3 = Schuyler:LTC3374: LTC3374 8-Channel 1A Buck DC-DC Regulator. http://cds.linear.com/docs/en/datasheet/3374f.pdf; MANPARTNUMBER: TC3374EUHF#PBF; MANUFACTURER: Linear Technology; PARTNUMBER: LTC3374EUHF#PBF-ND; SUPPLIER: DIGIKEY
U$4 = Schuyler:LT1963AEST-: LT1963A Series LDO in a 3 Lead SOT223 package. http://cds.linear.com/docs/en/datasheet/1963aff.pdf; PARTNUMBER: LT1963AEST-2.5#PBF-ND; SUPPLIER: DIGIKEY
U$5 = Schuyler:LT1963AEST-: LT1963A Series LDO in a 3 Lead SOT223 package. http://cds.linear.com/docs/en/datasheet/1963aff.pdf; PARTNUMBER: LT1963AEST-3.3#PBF-ND; SUPPLIER: DIGIKEY
U$6 = Schuyler:TMP421: Remote and local temperature sensor (+/- 1C) from TI. TMP421. http://www.ti.com/lit/ds/symlink/tmp421.pdf; MANPARTNUMBER: TMP421AIDCNT; MANUFACTURER: Texas Instruments; PARTNUMBER: 296-21990-1-ND; SUPPLIER: DIGIKEY
U$7 = Schuyler:LMH6555: LMH6555 is a low distortion 1.2 GHz differential driver. It can be configured for single sided input. Verified=false.; MANPARTNUMBER: LMH6555SQ/NOPB; MANUFACTURER: Texas Instruments; PARTNUMBER: LMH6555SQ/NOPBCT-ND; SUPPLIER: DIGIKEY
U$8 = Schuyler:LMV321: LMV321 Low Voltage Rail-to-rail op amp from TI. Verified=false.; MANPARTNUMBER: LMV321IDCKR; MANUFACTURER: Texas Instruments; PARTNUMBER: 296-9568-1-ND; SUPPLIER: DIGIKEY
U$9 = Schuyler:DAC101C081: 10-bit DAC from TI. http://www.ti.com/lit/ds/symlink/dac101c081.pdf; PARTNUMBER: DAC101C081CIMK/NOPBCT-ND; SUPPLIER: DIGIKEY
U$10 = Schuyler:XCFXXS: XCFxxS Xilinx Program Flash.; PARTNUMBER: 122-1288-5-ND; SUPPLIER: DIGIKEY
U$11 = Schuyler:SLIDER_SPDT: SPDT Slider switch from C&K Corp.; MANPARTNUMBER: 1101M2S3AQE2; MANUFACTURER: C&K Components; PARTNUMBER: CKN5006-ND; SUPPLIER: DIGIKEY
X1 X3 = con-coax:SMA-: SMA 50 Ohm End Launch Jack Receptacle - Round Contact Johnson Components Source: www.johnsoncomponents.com .. J502-ND.pdf; MANPARTNUMBER: 142-0701-801; MANUFACTURER: Emerson Network Power Connectivity Johnson; MF: JOHNSON COMPONENTS; MPN: 142-0701-801; OC_FARNELL: 1608592; OC_NEWARK: 90F2624; PARTNUMBER: J502-ND; SUPPLIER: DIGIKEY
X2 = con-molex:87832-14: Milli-Grid Header 2.00mm (.079") Pitch; OC_FARNELL: 7434698; OC_NEWARK: unknown; PARTNUMBER: 57J0374; SUPPLIER: Newark
Y1 = Schuyler:SI530: Crystal Oscillator from Silicon Labs. Factory progrramed between 0.01 and 1.4 GHz.; PARTNUMBER: 530FC500M000DG; SUPPLIER: SILICON LABS
Y2 = Schuyler:SI500S: Silicon Labs SI500S programmable oscillator. https://www.silabs.com/Support%20Documents/TechnicalDocs/Si500S.pdf; PARTNUMBER: 500SAAA-ACF-ND; SUPPLIER: DIGIKEY
Y3 = Schuyler:DS1088L_: MAXIM DS1088L Fixed frequency EconOscillator. Factory programmed between 321kHz and 133MHz. http://datasheets.maximintegrated.com/en/ds/DS1088-DS1088L.pdf; PARTNUMBER: DS1088LU-100+-ND; SUPPLIER: DIGIKEY